# Altium schematic sheet MCU.SchDoc: QUTMS - HVBoard - MCU
size A4; DocumentNumber: 5; SheetNumber: 5; SheetTotal: 5
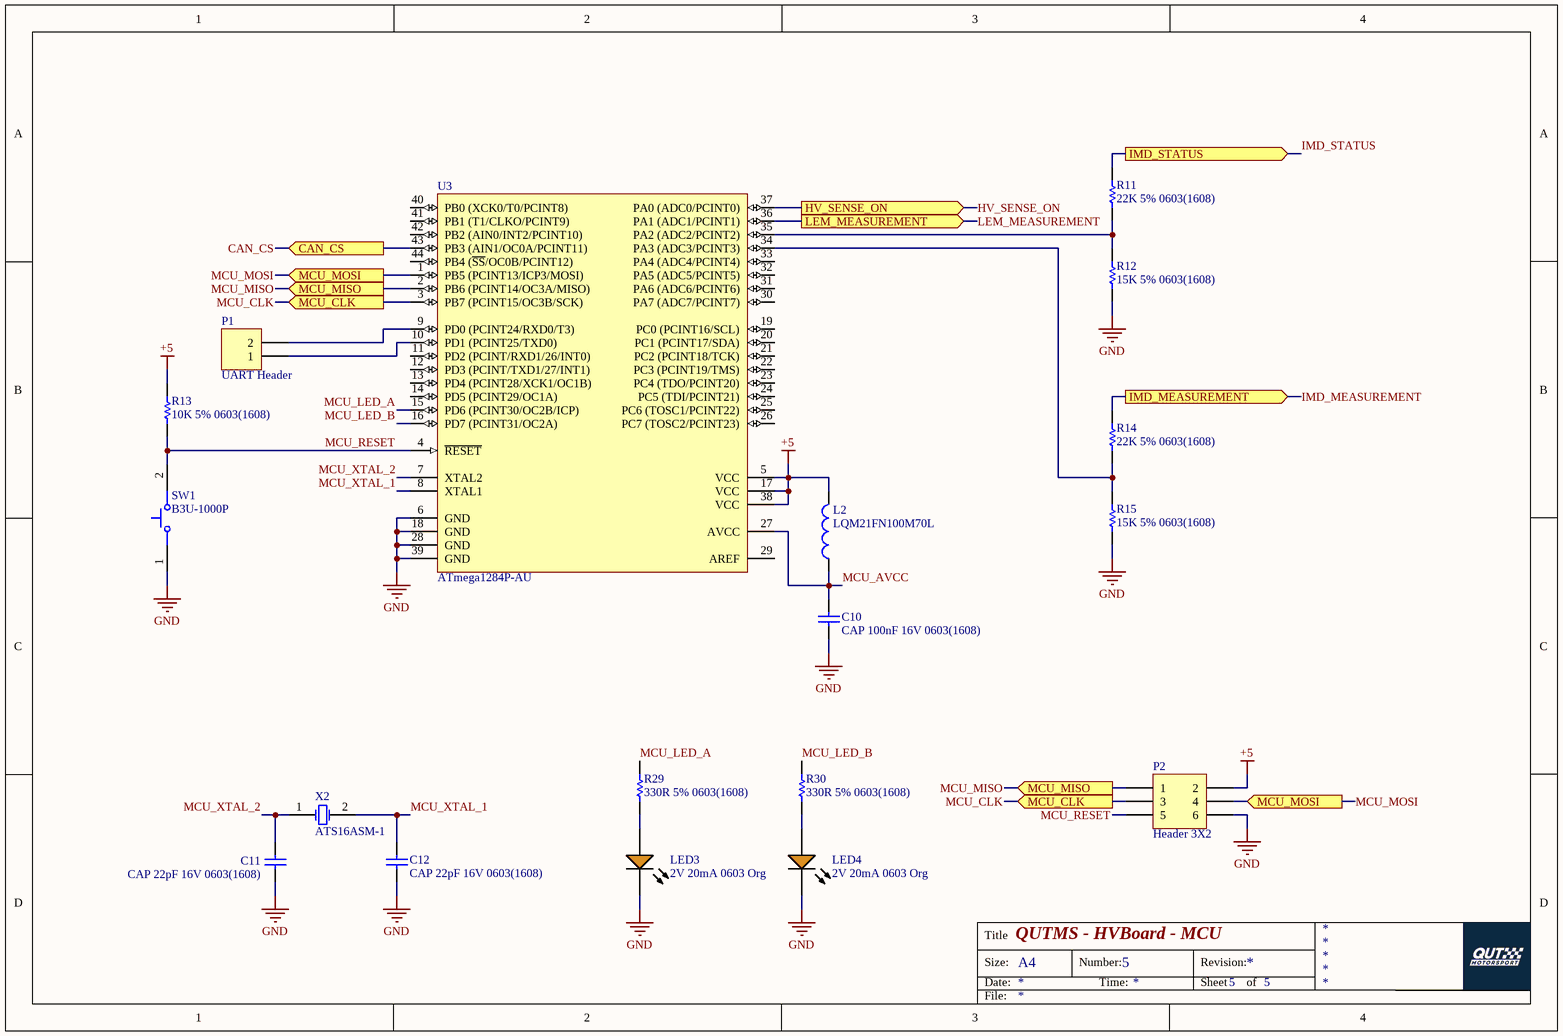
[diagram p0: MCU.SchDoc]

## Parts
C10  CAP 100nF 16V 0603(1608)  [CAPC0603(1608)100_M]
C11  CAP 22pF 16V 0603(1608)  [CAPC0603(1608)100_L]
C12  CAP 22pF 16V 0603(1608)  [CAPC0603(1608)100_L]
L2  LQM21FN100M70L  [MURA-IND0805_L]
LED3  2V 20mA 0603 Org  [KING-LED0603-25-ORANGE_V]
LED4  2V 20mA 0603 Org  [KING-LED0603-25-ORANGE_V]
P1  UART Header  [HDR1X2]
P2  Header 3X2  [HDR2X3]
R11  22K 5% 0603(1608)  [RESC0603(1608)_M]
R12  15K 5% 0603(1608)  [RESC0603(1608)_M]
R13  10K 5% 0603(1608)  [RESC0603(1608)_N]
R14  22K 5% 0603(1608)  [RESC0603(1608)_M]
R15  15K 5% 0603(1608)  [RESC0603(1608)_M]
R29  330R 5% 0603(1608)  [RESC0603(1608)_L]
R30  330R 5% 0603(1608)  [RESC0603(1608)_L]
SW1  B3U-1000P  [OMRON-B3U-1000_V]
U3  ATmega1284P-AU  [44A_N]
X2  ATS16ASM-1  [CTS-ATS-SM-XTAL-2]

## Ports
CAN_CS (in), HV_SENSE_ON (out), IMD_MEASUREMENT (out), IMD_STATUS (out), LEM_MEASUREMENT (out), MCU_CLK (in), MCU_MISO (in), MCU_MOSI (in)

## Nets
+5: L2.2 P2.2 R13.2 U3.5(VCC) U3.17(VCC) U3.38(VCC)
GND: C10.1 C11.1 C12.1 LED3.2(K) LED4.2(K) P2.6 R12.1 R15.1 SW1.1 U3.6(GND) U3.18(GND) U3.28(GND) U3.39(GND)
CAN_CS: U3.43(PB3_(AIN1/OC0A/PCINT11)) ; port CAN_CS
HV_SENSE_ON: U3.37(PA0_(ADC0/PCINT0)) ; port HV_SENSE_ON
IMD_MEASUREMENT: R14.2 ; port IMD_MEASUREMENT
IMD_STATUS: R11.2 ; port IMD_STATUS
LEM_MEASUREMENT: U3.36(PA1_(ADC1/PCINT1)) ; port LEM_MEASUREMENT
MCU_AVCC: C10.2 L2.1 U3.27(AVCC)
MCU_CLK: P2.3 U3.3(PB7_(PCINT15/OC3B/SCK)) ; port MCU_CLK
MCU_LED_A: R29.1 U3.15(PD6_(PCINT30/OC2B/ICP))
MCU_LED_B: R30.1 U3.16(PD7_(PCINT31/OC2A))
MCU_MISO: P2.1 U3.2(PB6_(PCINT14/OC3A/MISO)) ; port MCU_MISO
MCU_MOSI: P2.4 U3.1(PB5_(PCINT13/ICP3/MOSI)) ; port MCU_MOSI
MCU_RESET: P2.5 R13.1 SW1.2 U3.4(~{RESET})
MCU_XTAL_1: C12.2 U3.8(XTAL1) X2.2(X2)
MCU_XTAL_2: C11.2 U3.7(XTAL2) X2.1(X1)
NetLED3_1: LED3.1(A) R29.2
NetLED4_1: LED4.1(A) R30.2
NetP1_1: P1.1 U3.10(PD1_(PCINT25/TXD0))
NetP1_2: P1.2 U3.9(PD0_(PCINT24/RXD0/T3))
NetR11_1: R11.1 R12.2 U3.35(PA2_(ADC2/PCINT2))
NetR14_1: R14.1 R15.2 U3.34(PA3_(ADC3/PCINT3))

Not connected (* = marked no-connect by the designer): U3 11(PD2_(PCINT/RXD1/26/INT0)) 12(PD3_(PCINT/TXD1/27/INT1)) 13(PD4_(PCINT28/XCK1/OC1B)) 14(PD5_(PCINT29/OC1A)) 19(PC0_(PCINT16/SCL)) 20(PC1_(PCINT17/SDA)) 21(PC2_(PCINT18/TCK)) 22(PC3_(PCINT19/TMS)) 23(PC4_(TDO/PCINT20)) 24(PC5_(TDI/PCINT21)) 25(PC6_(TOSC1/PCINT22)) 26(PC7_(TOSC2/PCINT23)) 29(AREF) 30(PA7_(ADC7/PCINT7)) 31(PA6_(ADC6/PCINT6)) 32(PA5_(ADC5/PCINT5)) 33(PA4_(ADC4/PCINT4)) 40(PB0_(XCK0/T0/PCINT8)) 41(PB1_(T1/CLKO/PCINT9)) 42(PB2_(AIN0/INT2/PCINT10)) 44(PB4_(~{SS}/OC0B/PCINT12))

## Notes on the sheet
- Title
- Size:
- Date:
- A4
- Number:
- Time:
- Revision:
- Sheet
- of
- File:

## Library data of the parts
C10 = CMP-1035-02583-1: CAP 100nF 16V ±5% 0603 (1608 Metric) Thickness 1mm SMD; Tolerance: Â±5%; Case-Metric: 1608; Case-EIA: 0603; Rated Voltage: 16 V; Max Thickness: 1 mm; Technology: SMT; Value: 100nF
C11 C12 = CMP-1035-00806-1: CAP 22pF 16V ±1% 0603 (1608 Metric) Thickness 1mm SMD; Tolerance: Â±1%; Case-EIA: 0603; Case-Metric: 1608; Value: 22pF; Max Thickness: 1 mm; Rated Voltage: 16 V; Technology: SMT
L2 = CMP-2000-06587-1: Fixed Inductor, 10 uH, +/-20%, -55 to 125 degC, 2-Pin SMD (0805), RoHS, Tape and Reel; Manufacturer: Murata; Tolerance (%): 20%; DC Resistance: 0.6; Inductance-Nom: 10H; Rated Current-Max: 100mA; Package Reference: IND0805; Case Size/Dimension: 0805; Manufacturer URL: http://www.murata.com/; Package Description: 2-Pin Surface Mount Device, Body 2 x 1.25 mm; Datasheet URL: http://psearch.en.murata.com/inductor/product/LQM21FN100M70%23.pdf; Mounting Technology: SurfaceMount; Datasheet Version: 05/2016
LED3 LED4 = CMP-0239-00002-1: LED, SMT, 0603(1608), 0.25mm Tthickness, Super Bright Orange; PartNumber: APG1608SEKC/T; Forward Current: 30 mA; Power Dissipation: 75 mW; Reverse Voltage: 5 V; Packing: Reel; PackageDescription: 2-Pin SMT LED, 1.6 x 0.8 mm Body, 0.25mm Thickness; ComponentLink1URL: http://www.kingbrightusa.com/; PackageVersion: Rev. 4A, 12/2011; Storage Temperature: -40 to 85 degC; Mounting Technology: Surface Mount; ComponentLink2Description: Datasheet; DatasheetVersion: Rev. 4A, 12/2011; ComponentLink2URL: http://www.kingbrightusa.com/images/catalog/SPEC/APG1608SEKC-T.pdf; PackageReference: LED0603-25-ORANGE; ComponentLink1Description: Manufacturer URL
P1 = Header 2: LatestRevisionDate: 17-Jul-2002; LatestRevisionNote: Re-released for DXP Platform.; Publisher: Altium Limited
P2 = Header 3X2: Header, 3-Pin, Dual row; LatestRevisionDate: 17-Jul-2002; LatestRevisionNote: Re-released for DXP Platform.; Publisher: Altium Limited
R11 R14 = CMP-1012-00106-1: 22K 0.1W 5% 0603 (1608 Metric)  SMD; Case-Metric: 1608; Value: 22000.00 Ohm; Case-EIA: 0603; Power: 0.1 W; Tolerance: 5 %; Technology: SMT
R12 R15 = CMP-1012-00102-1: 15K 0.1W 5% 0603 (1608 Metric)  SMD; Value: 15000.00 Ohm; Case-Metric: 1608; Case-EIA: 0603; Power: 0.1 W; Technology: SMT; Tolerance: 5 %
R13 = CMP-1012-00098-1: 10K 0.1W 5% 0603 (1608 Metric)  SMD; Case-EIA: 0603; Value: 10000.00 Ohm; Case-Metric: 1608; Technology: SMT; Tolerance: 5 %; Power: 0.1 W
R29 R30 = CMP-1012-00062-1: 330R 0.1W 5% 0603 (1608 Metric)  SMD; Value: 330.00 Ohm; Case-EIA: 0603; Case-Metric: 1608; Tolerance: 5 %; Power: 0.1 W; Technology: SMT
SW1 = CMP-2100-03586-1: Ultra-Small Tactile Switch, 0.05 A, 12 V, -25 to 70 degC, 2-Pin SMD, RoHS, Tape and Reel; Manufacturer: Omron Electronic Components; Operating Force: 1.5N; Current Rating: 50mA; Voltage Rating (DC): 12V; Electrical Life: 200000Cycles; Actuator Length: 0.4mm; Insulation Resistance: 100MOhm; Switch Travel: 0.15mm; Throw Configuration: SPST; Illumination Type: Illuminated; Width: 3mm; Weight: 0.022g; Datasheet Version: 42005.0; Datasheet URL: http://www.omron.com/ecb/products/pdf/en-b3u.pdf; Height: 1.2mm; Package Quantity: 1; REACH SVHC: Unknown; Contact Current Rating: 50mA; Contact Material: Silver; Max Current Rating: 50mA; Package Reference: B3U-1000; Termination: SMD/SMT; Packaging: TapeandReel; Manufacturer URL: http://www.omron.com/; RoHSCompliant: true; Mount: SurfaceMount; Length: 4mm; Min Operating Temperature: -25degC; Depth: 2.5mm; Lead Free: LeadFree; Case/Package: SMD/SMT; Package Description: 2-Pin Surface Mount Device, Body 3 x 2.5 mm; Max Operating Temperature: 70degC; Orientation: Straight
U3 = CMP-0095-00577-1: 8-bit AVR Microcontroller, 128KB Flash, 4KB EEPROM, 16KB SRAM, 44-pin TQFP, Industrial Grade (-40°C to 85°C); PackageReference: 44A; Code_JEDEC: MS-026-ACB; ComponentLink3Description: ATmega164A/164PA/324A/324PA/644A/644PA/1284/1284P Summary; DatasheetVersion: revC, Jun-2011; PackageDescription: 44-Pin Plastic Thin Profile Quad Flat Pack, 10 x 10 x 1.0 mm Body, 0.8 mm Pitch (TQFP); ComponentLink3URL: http://www.atmel.com/dyn/resources/prod_documents/8272S.pdf; ComponentLink1URL: http://www.atmel.com/; ComponentLink1Description: Manufacturer URL; ComponentLink2Description: ATmega164A/164PA/324A/324PA/644A/644PA/1284/1284P Datasheet; ComponentLink2URL: http://www.atmel.com/dyn/resources/prod_documents/doc8272.pdf; PackageVersion: revC, Oct-2010
X2 = CMP-0585-00002-2: ATS-SM Series Quartz Crystal, 16 MHz, -20 to 70 degC, 11.1 x 4.83 x 4.3mm SMD, RoHS, Tape and Reel; Manufacturer: CTS Corporation; Shunt Capacitance (C0): 7.0 pF Max; Frequency: 16 MHz; Oscillation Mode: Fundamental or 3rd Overtone; Crystal Cut: AT-Cut; ESR Maximum: 40 Ohms; Drive Level (Type): 100 uW; PackageDescription: 2-Pin SMD, Body 11.1 x 4.83 mm, Pitch 8.5 mm; PackageReference: ATS-SM-XTAL-2; ComponentLink1URL: http://www.ctscorp.com/; PartNumber: ATS16ASM-1; RoHS: TRUE; ComponentLink1Description: Manufacturer URL; Operating Temperature: -20 to 70 degC; DatasheetVersion: Rev. K; ComponentLink2Description: Datasheet; Packing: Tape and Reel; ComponentLink2URL: http://www.ctscorp.com/components/Datasheets/008-0309-0.pdf; Mounting Technology: Surface Mount; ComponentLink3URL: http://www.ctscorp.com/components/Datasheets/008-0309-0.pdf; ComponentLink3Description: Package Specification